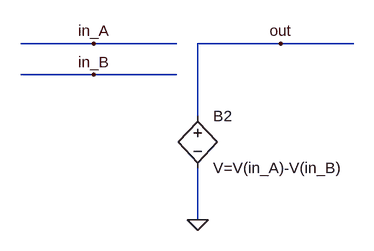
[diagram p0: schematic ideal_difference.asc]
ideal_difference.asc, the LTspice schematic file:
Version 4
SHEET 1 2652 680
WIRE 528 32 416 32
WIRE 656 32 528 32
WIRE 816 32 688 32
WIRE 928 32 816 32
WIRE 528 80 416 80
WIRE 656 80 528 80
WIRE 688 144 688 32
WIRE 688 304 688 224
FLAG 688 304 0
FLAG 528 32 in_A
FLAG 816 32 out
FLAG 528 80 in_B
SYMBOL bv 688 128 R0
SYMATTR InstName B2
SYMATTR Value V=V(in_A)-V(in_B)

The netlist it stands for:
* ideal_difference.asc
B2 out 0 V=V(in_A)-V(in_B)
.backanno
.end